# Altium schematic sheet 2014_FDP_Generic_Port_Strat.SchDoc
size A4
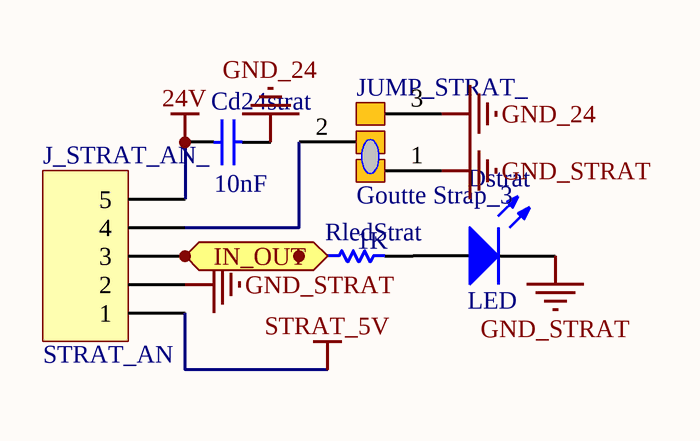
[diagram p0: 2014_FDP_Generic_Port_Strat.SchDoc]

## Parts
Cd24strat  10nF  [C0805_N]
Dstrat  LED  [LED_0805]
J_STRAT_AN_  STRAT_AN  [HE14_5]
JUMP_STRAT_  Goutte Strap_3  [Goutte Strap_3]
RledStrat  1K  [R1206_N]

## Ports
IN_OUT

## Nets
24V: Cd24strat.1 J_STRAT_AN_.5
GND_24: Cd24strat.2 JUMP_STRAT_.3
GND_STRAT: Dstrat.2(K) J_STRAT_AN_.2 JUMP_STRAT_.1
STRAT_5V: J_STRAT_AN_.1
IN_OUT: J_STRAT_AN_.3 RledStrat.1 ; port IN_OUT
NetDstrat_1: Dstrat.1(A) RledStrat.2
NetJ_STRAT_AN__4: J_STRAT_AN_.4 JUMP_STRAT_.2

## Library data of the parts
Cd24strat = Condensateur: Capacitor; Published: 8-Jun-2000; LatestRevisionDate: 17-Jul-2002; LatestRevisionNote: Re-released for DXP Platform.; PackageReference: RAD-0.3; Publisher: Altium Limited
Dstrat = LED: Typical LED; Published: 8-Jun-2000; LatestRevisionDate: 08-Jul-2005; LatestRevisionNote: Mech Layer 1 removed.; PackageReference: LED-1; Publisher: Altium Limited
J_STRAT_AN_ = BARRETTE5: Header, 5-Pin; LatestRevisionDate: 17-Jul-2002; LatestRevisionNote: Re-released for DXP Platform.; Publisher: Altium Limited
RledStrat = Resistor: Published: 8-Jun-2000; LatestRevisionDate: 17-Jul-2002; LatestRevisionNote: Re-released for DXP Platform.; PackageReference: AXIAL-0.5; Publisher: Altium Limited
JUMP_STRAT_ = Goutte Strap_3: LatestRevisionDate: 25/11/09; Publisher: Damien Guitton